# EAGLE design jan_ray2 (EAGLE 7.6.0)
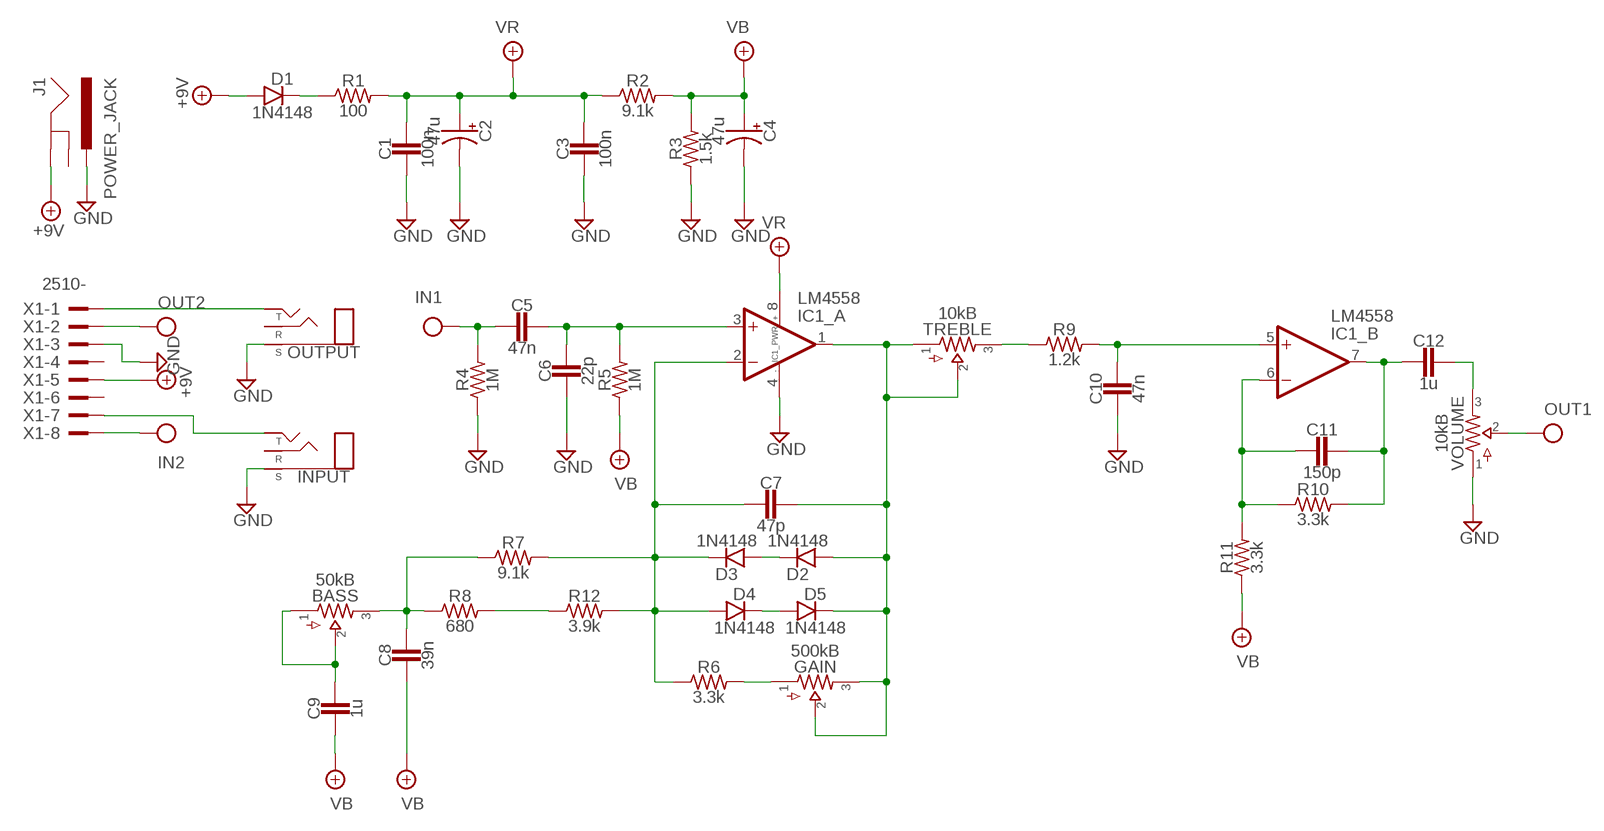
[diagram p0: schematic, sheet 1]

## Parts
BASS  50kB  POTS16MM  [16MM]
C1  100n  CER/FILMBOX.1  [BOX_SMALL]
C2  47u  0501  [050_020_1]
C3  100n  CER/FILMBOX.1  [BOX_SMALL]
C4  47u  0501  [050_020_1]
C5  47n  CER/FILMBOX.1  [BOX_SMALL]
C6  22p  CER/FILM2  [050X030_025_2]
C7  47p  CER/FILM2  [050X030_025_2]
C8  39n  CER/FILMBOX.1  [BOX_SMALL]
C9  1u  CER/FILMBOX.2  [BOX_MED]
C10  47n  CER/FILMBOX.1  [BOX_SMALL]
C11  150p  CER/FILM2  [050X030_025_2]
C12  1u  CER/FILMBOX.2  [BOX_MED]
D1  1N4148  DO35.2  [DO35-2]
D2  1N4148  DO35.2  [DO35-2]
D3  1N4148  DO35.2  [DO35-2]
D4  1N4148  DO35.2  [DO35-2]
D5  1N4148  DO35.2  [DO35-2]
GAIN  500kB  POTS16MM  [16MM]
IC1  LM4558  DUALTH  [DIL08]
INPUT  STEREONMJ  [NMJ6HCD2]
J1  POWER_JACK  [POWER_JACK_PTH]
OUTPUT  STEREONMJ  [NMJ6HCD2]
R1  100  R_.3B  [R0207/3]
R2  9.1k  R_.3B  [R0207/3]
R3  1.5k  R_.3B  [R0207/3]
R4  1M  R_.3B  [R0207/3]
R5  1M  R_.3B  [R0207/3]
R6  3.3k  R_.3B  [R0207/3]
R7  9.1k  R_.3B  [R0207/3]
R8  680  R_.3B  [R0207/3]
R9  1.2k  R_.3B  [R0207/3]
R10  3.3k  R_.3B  [R0207/3]
R11  3.3k  R_.3B  [R0207/3]
R12  3.9k  R_.3B  [R0207/3]
TREBLE  10kB  POTS16MM  [16MM]
VOLUME  10kB  POTS16MM  [16MM]
X1  2510-  [PAK100/2500-10]

## Nets
+9V: D1.A J1.GND X1.5
GND: C1.2 C2.- C3.2 C4.- C6.2 C10.2 IC1.4(_PWR:V-) INPUT.S J1.PWR OUTPUT.S R3.1 R4.1 VOLUME.1 X1.3
IN: C5.2 R4.2 X1.8
N$1: D1.C R1.1
N$2: INPUT.T X1.7
N$3: C5.1 C6.1 IC1.3(_A:+IN) R5.2
N$4: OUTPUT.T X1.1
N$5: C7.2 D3.C D4.A IC1.2(_A:-IN) R6.1 R7.2 R12.2
N$6: C7.1 D2.A D5.C GAIN.2 GAIN.3 IC1.1(_A:OUT) TREBLE.1 TREBLE.2
N$7: GAIN.1 R6.2
N$8: D2.C D3.A
N$9: D4.C D5.A
N$10: R8.2 R12.1
N$11: BASS.3 C8.1 R7.1 R8.1
N$12: R9.1 TREBLE.3
N$13: BASS.1 BASS.2 C9.1
N$14: C10.1 IC1.5(_B:+IN) R9.2
N$15: C11.2 IC1.6(_B:-IN) R10.1 R11.2
N$16: C11.1 C12.2 IC1.7(_B:OUT) R10.2
N$17: C12.1 VOLUME.3
OUT: VOLUME.2 X1.2
VB: C4.+ C8.2 C9.2 R2.2 R3.2 R5.1 R11.1
VR: C1.1 C2.+ C3.1 IC1.8(_PWR:V+) R1.2 R2.1
Unconnected: INPUT.R J1.GNDBREAK OUTPUT.R X1.4 X1.6

## Library data of the parts
BASS GAIN TREBLE VOLUME = pedals-potentiometers:POTS
C1 C3 C5-C12 = pedals-capacitors-film:CER/FILM: 47 - 120pF Xicon Ceramic Disc 2.5mm lead spacing
C2 C4 = pedals-capacitors-elec:050
D1-D5 = pedals-diodes:DO35: DO-35 Package Diodes: 1N914
IC1 = pedals-integrated circuits:DUAL: OP AMP
INPUT OUTPUT = pedals-jacks:STEREO
J1 = pedals-jacks:POWER_JACK: Power Jack Connector This is the standard 5.5mm barrel jack for power. The PTH is the most common, proven, reliable, footprint. The Slot footprint only works if the mill layer is transmitted to the PCB fab house so be warned. Here are the connectors we sell at SparkFun: DC Barrel Power Jack/Connector <https://www.sparkfun.com/products/119> (PRT-00119) DC Barrel Power Jack/Connector (SMD) <https://www.sparkfun.com/products/12748> (PRT-12748) DC Barrel Jack Adapter - Breadboard Compatible <https://www.sparkfun.com/products/10811> (PRT-10811) It is used on this SparkFun product (and many, many others): SparkFun RedBoard - Programmed with Arduino <https://www.sparkfun.com/products/12757> (DEV-12757) Also, if you need a mating power supply or connector, please check these out: Wall Adapter Power Supply - 9VDC 650mA <https://www.sparkfun.com/products/298> (TOL-00298) DC Barrel Jack Adapter - Male <https://www.sparkfun.com/products/10287> (PRT-10287); PROD_ID: CONN-08197
R1-R12 = pedals-resistors:R_
X1 = pedals-headers:2510-: 3M (TM) Pak 100 4-Wall Header Source: 3M; MF: 3M; MPN: 2510-6002UB; OC_FARNELL: 9838244; OC_NEWARK: 46F4725

## Board
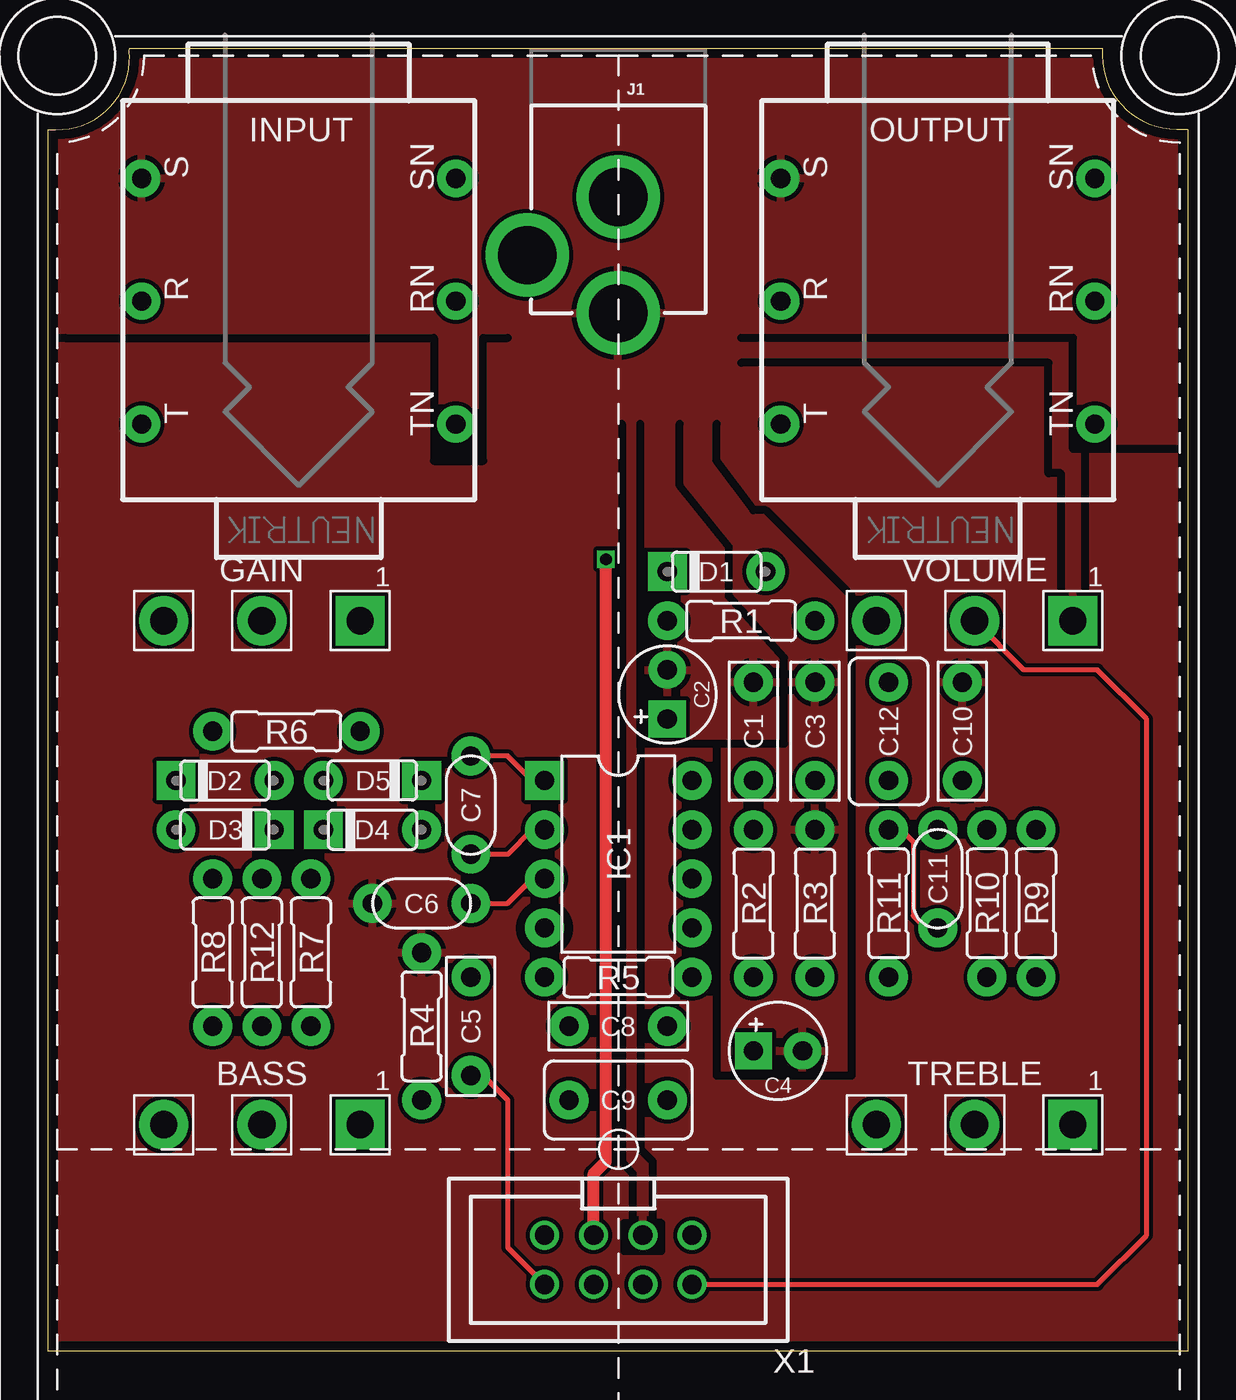
[diagram p1: board, top side]
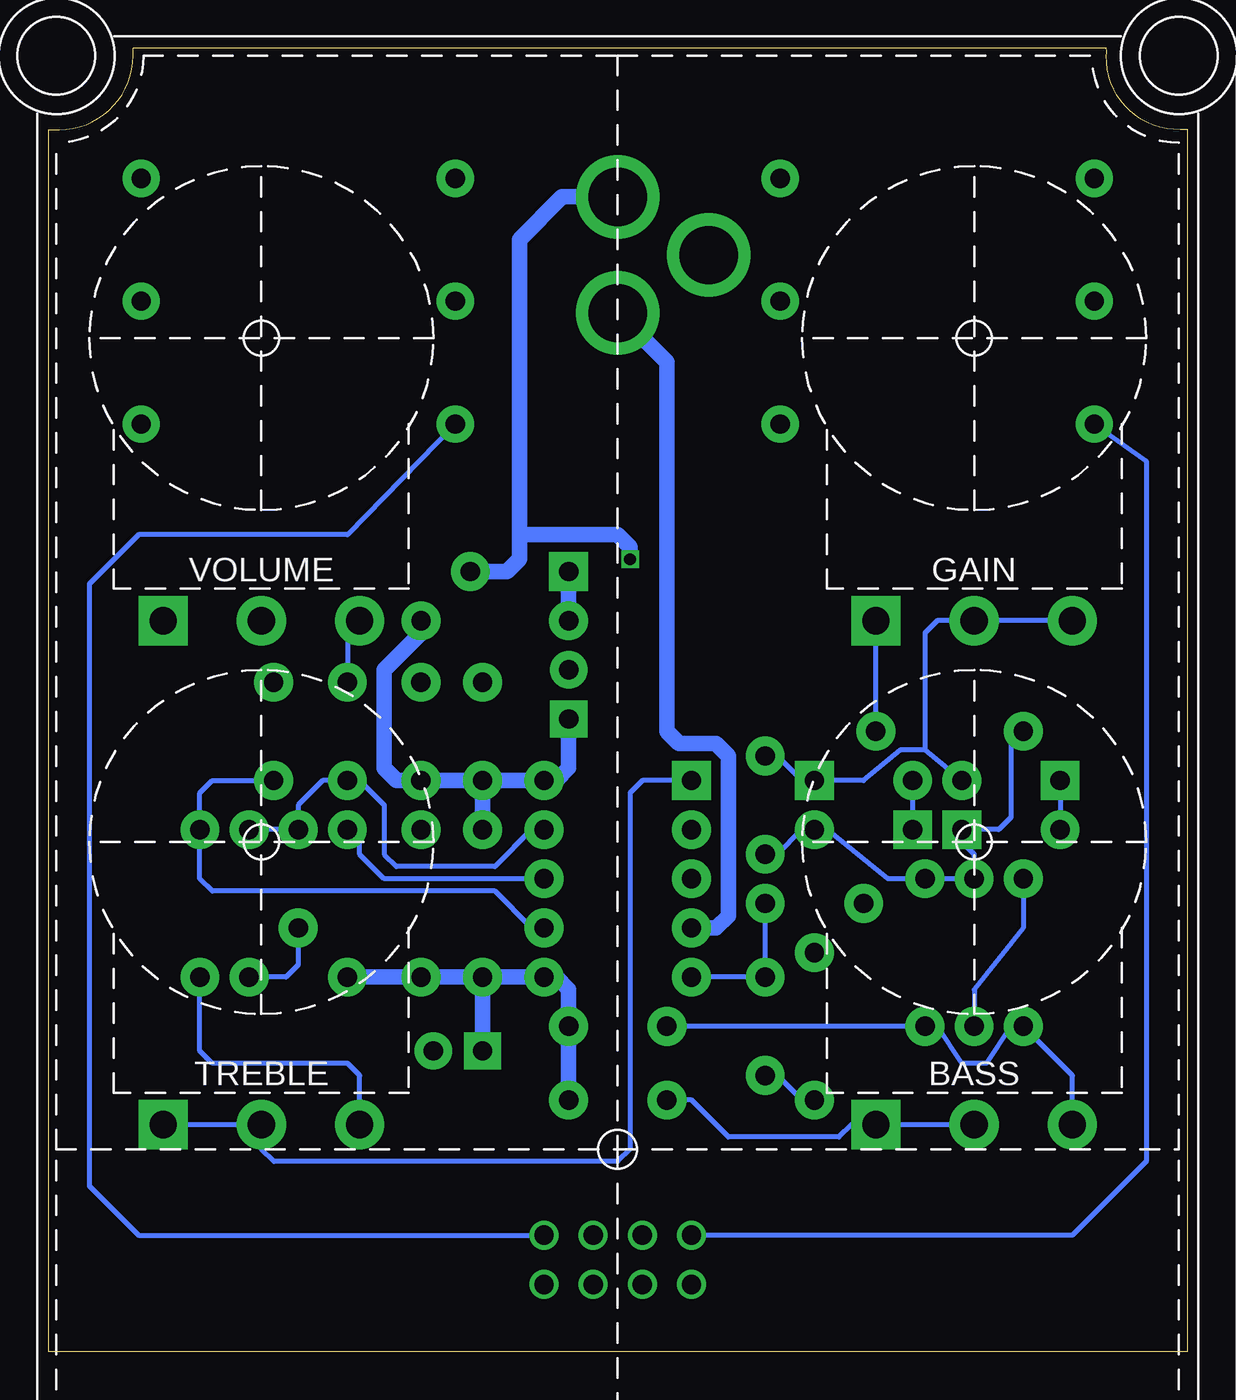
[diagram p2: board, bottom side, seen from below]

Size 58.86 x 67.31 mm. Coordinates in mm from the lower left corner, seen from the top.
Outline: 4.19,67.31 54.48,67.31 54.48,66.93 arc90 58.29,63.12 58.86,63.12 58.86,0 0,0 0,63.12 0.38,63.12 arc93 4.19,66.93 arc-7 4.19,67.31
Copper layers (1*16): Top 0.035mm / dielectric 1.6mm / Bottom 0.035mm
Design rules "Elecrow_2-layer_PCB_eagle_rule": minimum track width 6mil, minimum drill 12mil, track to track 6mil, track to pad 6mil, pad to pad 6mil, via to via 8mil, smd to smd 0mil, copper to edge 20mil, drill to drill 10mil, minimum pad ring 6mil, minimum via ring 6mil, stop-mask expansion 0mil, vias tented up to drill 100mil, thermal gap 10mil
tRestrict: area 24.6,20.8 to 26.7,22.9; 43 lines

### Footprints (pad centres in the part's own frame; a part is rotated, then mirrored left to right if it is on the bottom)
16MM = drill 1.4 pad 2.54 square: 1 5.08,0 | drill 1.4 pad 2.54: 2 0,0; 3 -5.08,0
BOX_SMALL = drill 1 pad 2: 1 -2.54,0; 2 2.54,0
050_020_1 = drill 1 pad 1.93 square: + -1.27,0 | drill 1 pad 1.93: - 1.27,0
050X030_025_2 = drill 1 pad 2: 1 -2.54,0; 2 2.54,0
BOX_MED = drill 1 pad 2: 1 -2.54,0; 2 2.54,0
DO35-2 = drill 1 pad 2: A 2.54,0 | drill 1 pad 2 square: C -2.54,0
DIL08 = drill 1 pad 2 square: 1 -3.81,-3.81 | drill 1 pad 2: 2 -1.27,-3.81; 3 1.27,-3.81; 4 3.81,-3.81; 5 3.81,3.81; 6 1.27,3.81; 7 -1.27,3.81; 8 -3.81,3.81
NMJ6HCD2 = drill 1 pad 1.93: R 0,8.115; RN 0,-8.115; S 6.35,8.115; SN 6.35,-8.115; T -6.35,8.115; TN -6.35,-8.115
POWER_JACK_PTH = drill 2.997 pad 4.318: GND 0,7.7; GNDBREAK 4.7,10.7; PWR 0,13.7
R0207/3 = drill 1 pad 2: 1 -3.81,0; 2 3.81,0
PAK100/2500-10 = drill 1 pad 1.422: 1 -3.81,-1.27; 2 -3.81,1.27; 3 -1.27,-1.27; 4 -1.27,1.27; 5 1.27,-1.27; 6 1.27,1.27; 7 3.81,-1.27; 8 3.81,1.27

### Placement (x,y rotation side)
BASS  11.03,11.7 0 top
C1  36.43,32.02 90 top
C2  31.98,33.93 90 top
C3  39.61,32.02 90 top
C4  37.7,15.51 0 top
C5  21.82,16.78 270 top
C6  19.28,23.13 180 top
C7  21.82,28.21 270 top
C8  29.44,16.78 0 top
C9  29.44,12.97 0 top
C10  47.22,32.02 90 top
C11  45.95,24.4 270 top
C12  43.41,32.02 270 top
D1  34.52,40.28 0 top
D2  9.12,29.48 0 top
D3  9.12,26.94 180 top
D4  16.74,26.94 0 top
D5  16.74,29.48 180 top
GAIN  11.03,37.74 0 top
IC1  29.44,25.67 270 top
INPUT  12.93,54.25 90 top
J1  29.44,67.34 180 top
OUTPUT  45.95,54.25 90 top
R1  35.79,37.74 0 top
R2  36.43,23.13 270 top
R3  39.6,23.13 270 top
R4  19.28,16.78 270 top
R5  29.44,19.32 180 top
R6  12.3,32.02 0 top
R7  13.57,20.59 90 top
R8  8.49,20.59 90 top
R9  51.03,23.13 90 top
R10  48.49,23.13 90 top
R11  43.41,23.13 90 top
R12  11.03,20.59 90 top
TREBLE  47.86,11.7 0 top
U$1  [125B]  29.45,10.43 0 top
VOLUME  47.86,37.74 0 top
X1  29.44,4.72 180 top

### Tracks (layer width: path | path; a pad name or v marks a point on that pad's centre or on a via)
+9V  (via drill 0.6)
  Top 0.61: X1.5 28.17,9.16 28.81,9.8 v28.81,40.91
  Bottom 0.813: J1.GND 32.31,59.64 34.52,57.42 34.52,42.18 | 34.52,42.18 34.52,40.91 35.16,40.28 D1.A | v28.81,40.91 28.81,41.55 29.44,42.18 34.52,42.18
GND
  Bottom 0.813: IC1.4 24.36,21.86 23.73,22.5 23.73,30.75 24.36,31.39 26.27,31.39 26.9,32.02 26.9,51.1 J1.PWR
  pour Top (isolate 0.203): 0.23,66.95 58.65,66.95 58.65,-4.81 0.23,-4.81
IN
  Top 0.254: C5.2 22.46,14.24 23.73,12.97 23.73,5.35 X1.8
  Bottom 0.254: R4.2 19.92,12.97 21.19,14.24 C5.2
N$1
  Bottom 0.813: D1.C R1.1
N$2
  Bottom 0.254: INPUT.T 2.14,45.99 2.14,9.8 5.95,5.99 X1.7
N$3
  Top 0.254: C6.1 23.73,23.13 25,24.4 IC1.3
  Bottom 0.254: C6.1 C5.1 R5.2
N$4
  Bottom 0.254: OUTPUT.T 43.41,42.18 54.21,42.18 56.75,39.64 56.75,8.53 54.21,5.99 X1.1
N$5
  Top 0.254: IC1.2 25,26.94 23.73,25.67 C7.2
  Bottom 0.254: C7.2 21.19,25.67 19.92,26.94 D4.A 18.65,26.94 15.47,24.4 R7.2 R12.2 11.03,25.67 11.66,26.31 D3.C 9.76,26.94 9.12,27.58 9.12,31.39 R6.1
N$6
  Top 0.254: IC1.1 25,29.48 23.73,30.75 C7.1
  Bottom 0.254: IC1.1 28.17,29.48 28.81,28.85 28.81,10.43 29.44,9.8 47.22,9.8 47.86,10.43 TREBLE.2 TREBLE.1 | C7.1 21.19,30.75 19.92,29.48 D5.C 16.74,29.48 14.84,31.07 13.57,31.07 | D2.A 13.57,31.07 | GAIN.3 GAIN.2 12.93,37.74 13.57,37.1 13.57,31.07
N$7
  Bottom 0.254: R6.2 GAIN.1
N$8
  Bottom 0.254: D2.C D3.A
N$9
  Bottom 0.254: D4.C D5.A
N$10
  Bottom 0.254: R8.2 8.49,21.86 11.03,18.69 R12.1
N$11
  Bottom 0.254: BASS.3 5.95,14.24 R8.1 9.12,16.78 10.39,14.88 11.66,14.88 12.93,16.78 R7.1 C8.1
N$12
  Bottom 0.254: TREBLE.3 42.78,14.24 43.41,14.88 50.4,14.88 51.03,15.51 R9.1
N$13
  Bottom 0.254: BASS.2 BASS.1 17.38,11.7 18.01,11.07 23.73,11.07 25.63,12.97 C9.1
N$14
  Bottom 0.254: IC1.5 33.89,21.86 35.79,23.77 50.4,23.77 51.03,24.4 R9.2 51.03,28.85 50.4,29.48 C10.1
N$15
  Top 0.254: R11.2 44.05,26.94 44.68,26.31 44.68,22.5 45.32,21.86 C11.2
  Bottom 0.254: C11.2 45.95,19.96 46.59,19.32 R10.1 | IC1.6 41.51,24.4 42.78,25.67 42.78,26.31 R11.2
N$16
  Bottom 0.254: R10.2 C11.1 45.95,28.21 44.68,29.48 C12.2 42.78,29.48 41.51,28.21 41.51,25.67 40.87,25.04 35.79,25.04 33.89,26.94 IC1.7
N$17
  Bottom 0.254: VOLUME.3 43.41,37.1 C12.1
OUT
  Top 0.254: X1.2 54.21,3.45 56.75,5.99 56.75,32.66 54.21,35.2 50.4,35.2 VOLUME.2
VB
  Bottom 0.61: R5.1 32.62,19.32
  Bottom 0.813: R2.2 C4.+ | R5.1 R2.2 | R2.2 R3.2 R11.1 | 32.62,19.32 31.98,18.69 C8.2 C9.2
VR
  Bottom 0.61: 32.62,29.48 IC1.8
  Bottom 0.813: C1.1 C3.1 40.87,29.48 41.51,30.12 41.51,35.2 39.6,37.1 R1.2 | C1.1 R2.1 | IC1.8 C1.1 | C2.+ 31.98,30.12 32.62,29.48